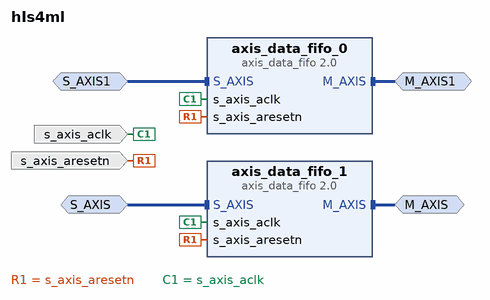
[diagram p0: block diagram of the top level]
# Vivado block design hls4ml, xck26-sfvc784-2LV-c, Vivado 2023.2
create_bd_design hls4ml

create_bd_intf_port -mode Master -vlnv xilinx.com:interface:axis_rtl:1.0 M_AXIS
set_property -dict {CONFIG.FREQ_HZ 99999001} [get_bd_intf_ports M_AXIS]
create_bd_intf_port -mode Master -vlnv xilinx.com:interface:axis_rtl:1.0 M_AXIS1
set_property -dict {CONFIG.FREQ_HZ 99999001} [get_bd_intf_ports M_AXIS1]
create_bd_intf_port -mode Slave -vlnv xilinx.com:interface:axis_rtl:1.0 S_AXIS
set_property -dict [list \
  CONFIG.FREQ_HZ 99999001 \
  CONFIG.HAS_TKEEP 1 \
  CONFIG.HAS_TLAST 1 \
  CONFIG.HAS_TREADY 1 \
  CONFIG.HAS_TSTRB 0 \
  CONFIG.LAYERED_METADATA undef \
  CONFIG.TDATA_NUM_BYTES 4 \
  CONFIG.TDEST_WIDTH 0 \
  CONFIG.TID_WIDTH 0 \
  CONFIG.TUSER_WIDTH 0 \
] [get_bd_intf_ports S_AXIS]
create_bd_intf_port -mode Slave -vlnv xilinx.com:interface:axis_rtl:1.0 S_AXIS1
set_property -dict [list \
  CONFIG.FREQ_HZ 99999001 \
  CONFIG.HAS_TKEEP 1 \
  CONFIG.HAS_TLAST 1 \
  CONFIG.HAS_TREADY 1 \
  CONFIG.HAS_TSTRB 0 \
  CONFIG.LAYERED_METADATA undef \
  CONFIG.TDATA_NUM_BYTES 4 \
  CONFIG.TDEST_WIDTH 0 \
  CONFIG.TID_WIDTH 0 \
  CONFIG.TUSER_WIDTH 0 \
] [get_bd_intf_ports S_AXIS1]
create_bd_port -dir I -type clk s_axis_aclk
set_property -dict [list \
  CONFIG.ASSOCIATED_BUSIF M_AXIS:S_AXIS:M_AXIS1:S_AXIS1 \
  CONFIG.ASSOCIATED_RESET s_axis_aresetn \
  CONFIG.FREQ_HZ 99999001 \
] [get_bd_ports s_axis_aclk]
create_bd_port -dir I -type rst s_axis_aresetn

create_bd_cell -type ip -vlnv xilinx.com:ip:axis_data_fifo:2.0 axis_data_fifo_0
create_bd_cell -type ip -vlnv xilinx.com:ip:axis_data_fifo:2.0 axis_data_fifo_1

# ---- connections ----

connect_bd_intf_net [get_bd_intf_ports M_AXIS1] [get_bd_intf_pins axis_data_fifo_0/M_AXIS]
connect_bd_intf_net [get_bd_intf_ports M_AXIS] [get_bd_intf_pins axis_data_fifo_1/M_AXIS]
connect_bd_intf_net -intf_net dfx_unified_0_M_AXIS_DS0 [get_bd_intf_ports S_AXIS1] [get_bd_intf_pins axis_data_fifo_0/S_AXIS]
connect_bd_intf_net -intf_net dfx_unified_0_M_AXIS_DS1 [get_bd_intf_ports S_AXIS] [get_bd_intf_pins axis_data_fifo_1/S_AXIS]
connect_bd_net -net dfx_unified_0_pr_reset [get_bd_ports s_axis_aresetn] \
  [get_bd_pins axis_data_fifo_0/s_axis_aresetn] [get_bd_pins axis_data_fifo_1/s_axis_aresetn]
connect_bd_net -net zynq_ultra_ps_e_0_pl_clk0 [get_bd_ports s_axis_aclk] \
  [get_bd_pins axis_data_fifo_0/s_axis_aclk] [get_bd_pins axis_data_fifo_1/s_axis_aclk]

validate_bd_design
save_bd_design
